# EAGLE design Terrarium (EAGLE 7.5.0)
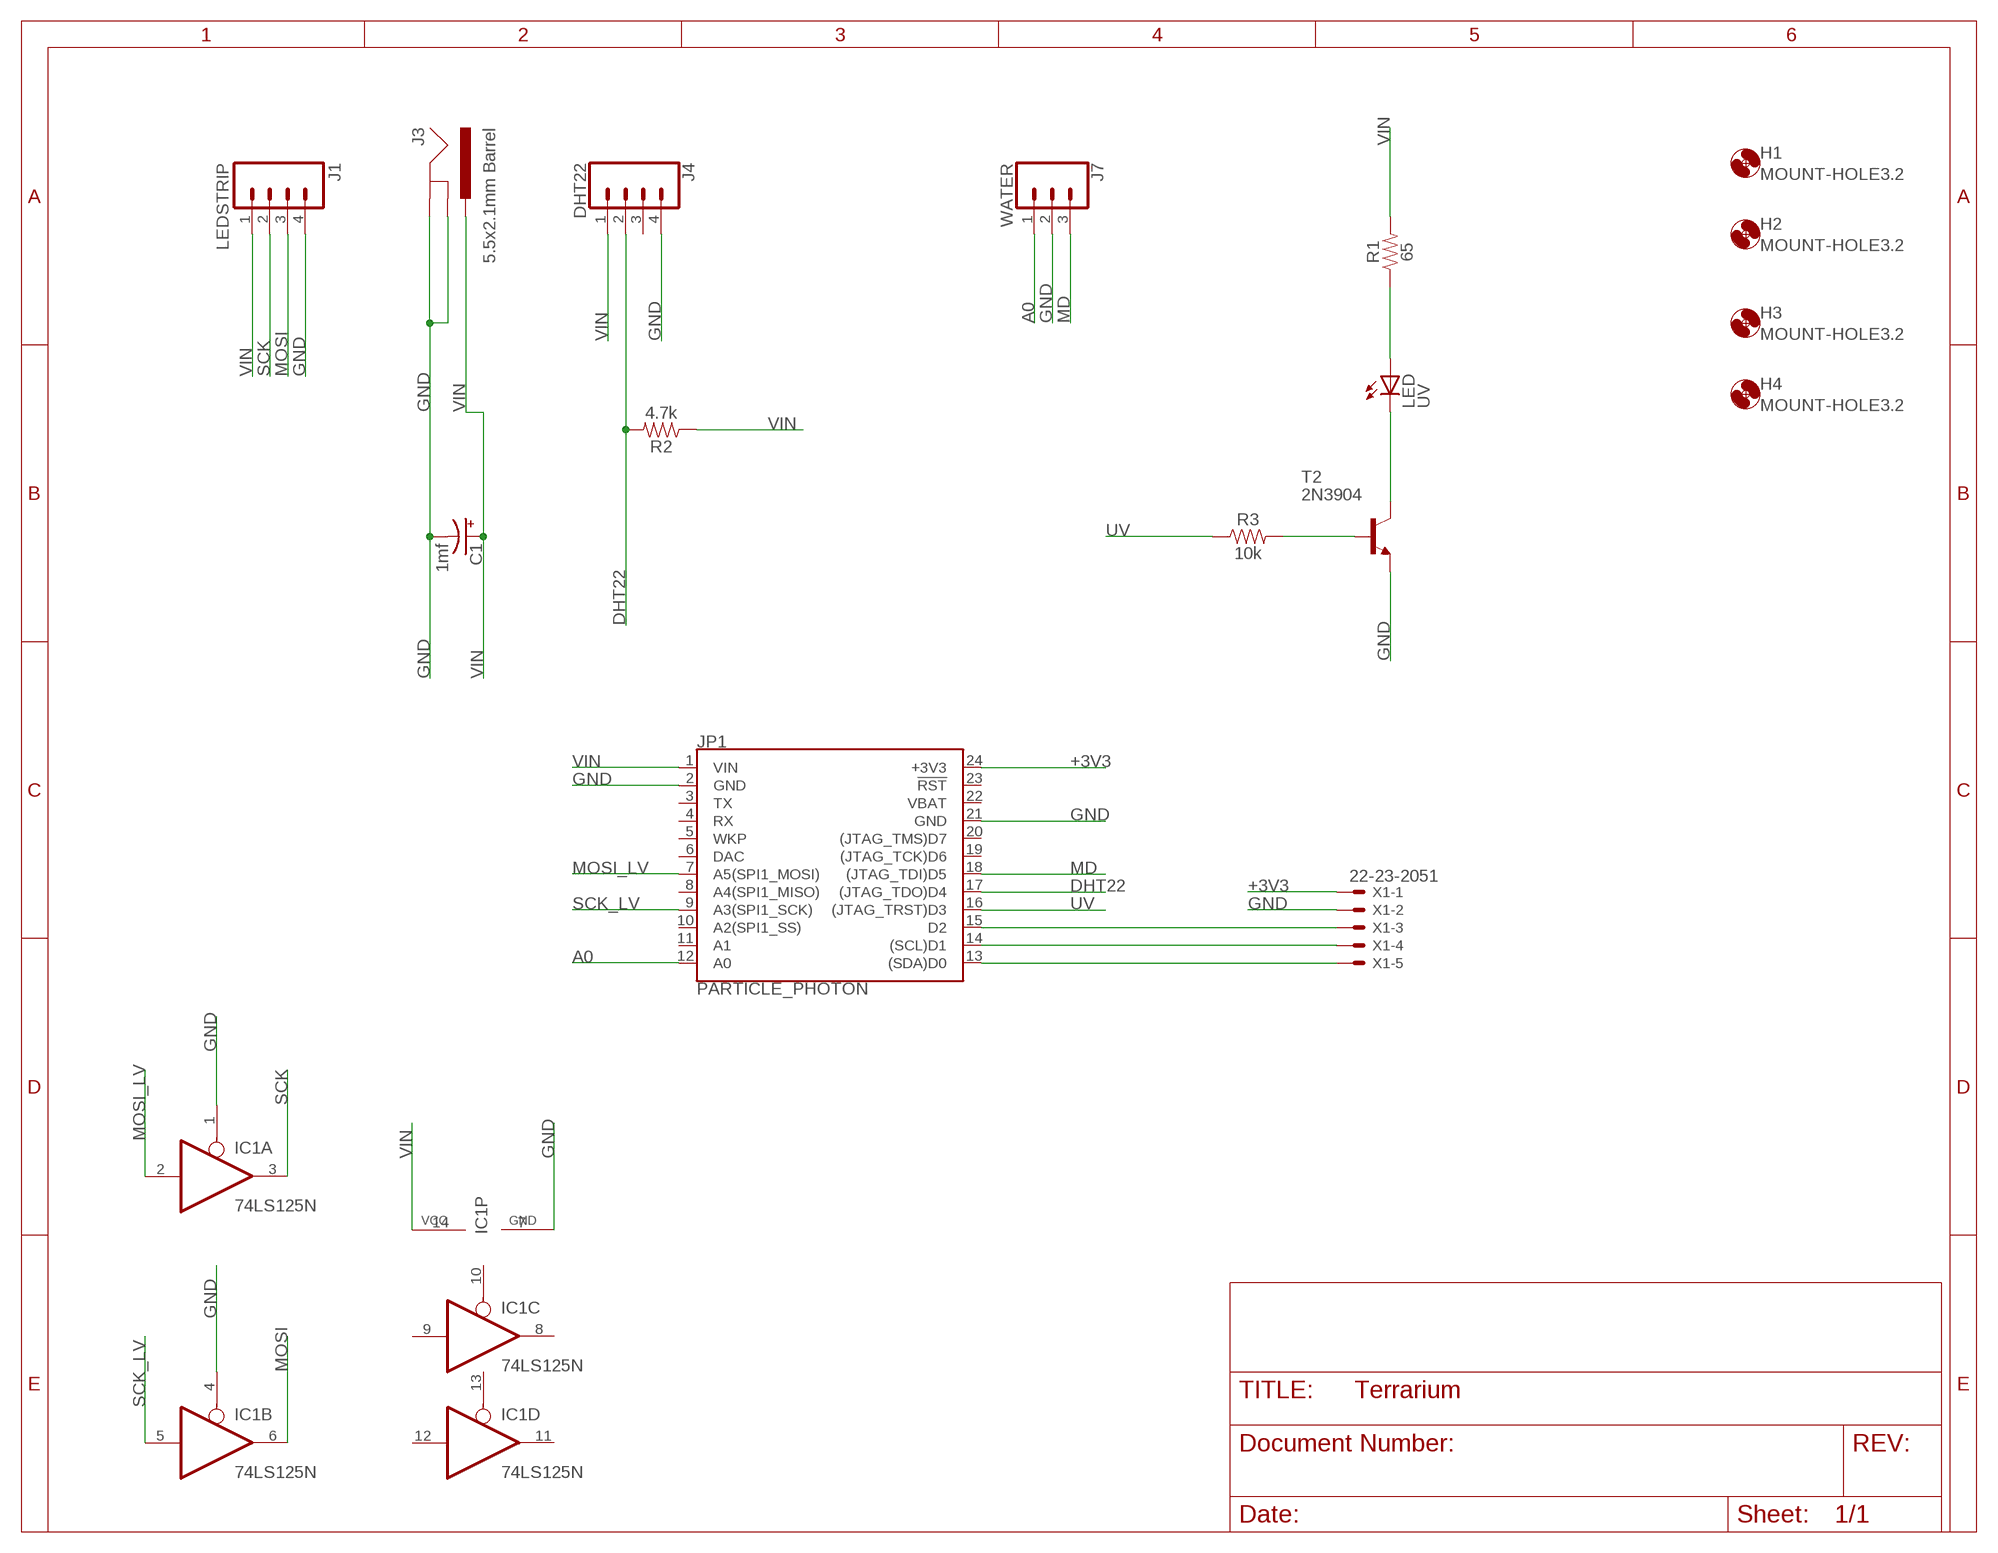
[diagram p0: schematic, sheet 1]

## Parts
C1  1mf  1000UF-RADIAL-5MM-35V-20%-KIT  [CPOL-RADIAL-5MM-10MM-KIT]
H1  MOUNT-HOLE3.2  [3,2]
H2  MOUNT-HOLE3.2  [3,2]
H3  MOUNT-HOLE3.2  [3,2]
H4  MOUNT-HOLE3.2  [3,2]
IC1  74LS125N  [DIL14]
J1  LEDSTRIP  M04PTH  [1X04@1]
J3  5.5x2.1mm Barrel  POWER_JACKSMD  [POWER_JACK_SMD]
J4  DHT22  CONN_04  [1X04]
J7  WATER  CONN_03  [1X03]
JP1  PARTICLE_PHOTON  [PARTICLE_PHOTON]
LED  UV  LED5MM  [LED5MM]
R1  65  100OHM-HORIZ-1/4W-1%  [AXIAL-0.3]
R2  4.7k  10KOHM-HORIZ-1/4W-5%  [AXIAL-0.3]
R3  10k  1KOHM-HORIZ-1/4W-5%  [AXIAL-0.3]
T2  2N3904  [TO92]
X1  22-23-2051  [22-23-2051]

## Nets
+3V3: JP1.24(+3V3) X1.1
A0: J7.1 JP1.12(A0)
DHT22: J4.2 JP1.17((JTAG_TDO)D4) R2.P$2
GND: C1.- IC1.1(A:OE) IC1.4(B:OE) IC1.7(P:GND) J1.4 J3.GND(GNDBREAK) J3.P$4(GND) J4.4 J7.2 JP1.2(GND) JP1.21(GND) T2.3(E) X1.2
MD: J7.3 JP1.18((JTAG_TDI)D5)
MOSI: IC1.6(B:O) J1.3
MOSI_LV: IC1.2(A:I) JP1.7(A5(SPI1_MOSI))
N$2: R3.P$2 T2.2(B)
N$3: JP1.13((SDA)D0) X1.5
N$4: LED.K(C) T2.1(C)
N$5: LED.A R1.P$1
N$6: JP1.14((SCL)D1) X1.4
N$7: JP1.15(D2) X1.3
SCK: IC1.3(A:O) J1.2
SCK_LV: IC1.5(B:I) JP1.9(A3(SPI1_SCK))
UV: JP1.16((JTAG_TRST)D3) R3.P$1
VIN: C1.+ IC1.14(P:VCC) J1.1 J3.VIN0(PWR) J4.1 JP1.1(VIN) R1.P$2 R2.P$1
Unconnected: IC1.8(C:O) IC1.9(C:I) IC1.10(C:OE) IC1.11(D:O) IC1.12(D:I) IC1.13(D:OE) J4.3 JP1.3(TX) JP1.4(RX) JP1.5(WKP) JP1.6(DAC) JP1.8(A4(SPI1_MISO)) JP1.10(A2(SPI1_SS)) JP1.11(A1) JP1.19((JTAG_TCK)D6) JP1.20((JTAG_TMS)D7) JP1.23(!RST!)

## Power pins joined to a net without a drawn wire
VBAT: JP1.22(VBAT)

## Library data of the parts
C1 = SparkFun-Capacitors:1000UF: 1,000µF/1mF ceramic capacitors A capacitor is a passive two-terminal electrical component used to store electrical energy temporarily in an electric field. CAP-08070; PROD_ID: CAP-09538
H1-H4 = holes:MOUNT-HOLE: MOUNTING HOLE with drill center marker
IC1 = adafruit:74*125: Quad bus BUFFER, 3-state
J1 = SparkFun-Connectors:M04: Header 4 Standard 4-pin 0.1" header. Use with straight break away headers (SKU : PRT-00116), right angle break away headers (PRT-00553), swiss pins (PRT-00743), machine pins (PRT-00117), and female headers (PRT-00115). Molex polarized connector foot print use with SKU : PRT-08231 with associated crimp pins and housings. 1MM SMD Version SKU: PRT-10208; PROD_ID: CONN-09696
J3 = SparkFun-Connectors:POWER_JACK: Power Jack Connector This is the standard 5.5mm barrel jack for power. The PTH is the most common, proven, reliable, footprint. The Slot footprint only works if the mill layer is transmitted to the PCB fab house so be warned. Here are the connectors we sell at SparkFun: DC Barrel Power Jack/Connector <https://www.sparkfun.com/products/119> (PRT-00119) DC Barrel Power Jack/Connector (SMD) <https://www.sparkfun.com/products/12748> (PRT-12748) DC Barrel Jack Adapter - Breadboard Compatible <https://www.sparkfun.com/products/10811> (PRT-10811) It is used on this SparkFun product (and many, many others): SparkFun RedBoard - Programmed with Arduino <https://www.sparkfun.com/products/12757> (DEV-12757) Also, if you need a mating power supply or connector, please check these out: Wall Adapter Power Supply - 9VDC 650mA <https://www.sparkfun.com/products/298> (TOL-00298) DC Barrel Jack Adapter - Male <https://www.sparkfun.com/products/10287> (PRT-10287); PROD_ID: CONN-08106; SF_ID: PRT-12748
J4 = SparkFun-Connectors:CONN_04: Multi connection point. Often used as Generic Header-pin footprint for 0.1 inch spaced/style header connections On any of the 0.1 inch spaced packages, you can populate with these: Break Away Headers - Straight <https://www.sparkfun.com/products/116> (PRT-00116) Break Away Male Headers - Right Angle <https://www.sparkfun.com/products/553> (PRT-00553) Female Headers <https://www.sparkfun.com/products/115> (PRT-00115) Break Away Headers - Machine Pin <https://www.sparkfun.com/products/117> (PRT-00117) Break Away Female Headers - Swiss Machine Pin <https://www.sparkfun.com/products/743> (PRT-00743) For SCREWTERMINALS and SPRING TERMINALS visit here: Screw Terimnals on SparkFun.com <https://www.sparkfun.com/search/results?term=Screw+Terminals> (5mm/3.5mm/2.54mm spacing) This device is also useful as a general connection point to wire up your design to another part of your project. Our various solder wires solder well into these plated through hole pads. Hook-Up Wire - Assortment (Stranded, 22 AWG) <https://www.sparkfun.com/products/11375> (PRT-11375) Hook-Up Wire - Assortment (Solid Core, 22 AWG) <https://www.sparkfun.com/products/11367> (PRT-11367) View the entire wire category on our website here <https://www.sparkfun.com/categories/141> Special notes: Molex polarized connector foot print use with SKU : PRT-08231 with associated crimp pins and housings. 1MM SMD Version SKU: PRT-10208; PROD_ID: CONN-09696
J7 = SparkFun-Connectors:CONN_03: Multi connection point. Often used as Generic Header-pin footprint for 0.1 inch spaced/style header connections On any of the 0.1 inch spaced packages, you can populate with these: Break Away Headers - Straight <https://www.sparkfun.com/products/116> (PRT-00116) Break Away Male Headers - Right Angle <https://www.sparkfun.com/products/553> (PRT-00553) Female Headers <https://www.sparkfun.com/products/115> (PRT-00115) Break Away Headers - Machine Pin <https://www.sparkfun.com/products/117> (PRT-00117) Break Away Female Headers - Swiss Machine Pin <https://www.sparkfun.com/products/743> (PRT-00743) Stackable Header - 3 Pin (Female, 0.1") <https://www.sparkfun.com/products/13875> (PRT-13875) For SCREWTERMINALS and SPRING TERMINALS visit here: Screw Terimnals on SparkFun.com <https://www.sparkfun.com/search/results?term=Screw+Terminals> (5mm/3.5mm/2.54mm spacing) This device is also useful as a general connection point to wire up your design to another part of your project. Our various solder wires solder well into these plated through hole pads. Hook-Up Wire - Assortment (Stranded, 22 AWG) <https://www.sparkfun.com/products/11375> (PRT-11375) Hook-Up Wire - Assortment (Solid Core, 22 AWG) <https://www.sparkfun.com/products/11367> (PRT-11367) View the entire wire category on our website here <https://www.sparkfun.com/categories/141> Special notes: Molex polarized connector foot print use with SKU : PRT-08232 with associated crimp pins and housings.
JP1 = SparkFun-Boards:PARTICLE_PHOTON: Particle Photon Footprint of the Particle Photon that is used as a basis for many Photon shields. SparkFun Products: Particle Photon <https://www.sparkfun.com/products/13764> SparkFun Photon ProtoShield <https://www.sparkfun.com/products/13598> SparkFun Photon micro OLED Shield <https://www.sparkfun.com/products/13628> SparkFun Photon IMU Shield <https://www.sparkfun.com/products/13629> SparkFun Photon Battery Shield <https://www.sparkfun.com/products/13626>
LED = adafruit:LED: LED OSRAM: - CHIPLED LG R971, LG N971, LY N971, LG Q971, LY Q971, LO R971, LY R971 LH N974, LH R974 LS Q976, LO Q976, LY Q976 LO Q996 - Hyper CHIPLED LW Q18S LB Q993, LB Q99A, LB R99A - SideLED LS A670, LO A670, LY A670, LG A670, LP A670 LB A673, LV A673, LT A673, LW A673 LH A674 LY A675 LS A676, LA A676, LO A676, LY A676, LW A676 LS A679, LY A679, LG A679 - Hyper Micro SIDELED® LS Y876, LA Y876, LO Y876, LY Y876 LT Y87S - SmartLED LW L88C, LW L88S LB L89C, LB L89S, LG L890 LS L89K, LO L89K, LY L89K LS L896, LA L896, LO L896, LY L896 - TOPLED LS T670, LO T670, LY T670, LG T670, LP T670 LSG T670, LSP T670, LSY T670, LOP T670, LYG T670 LG T671, LOG T671, LSG T671 LB T673, LV T673, LT T673, LW T673 LH T674 LS T676, LA T676, LO T676, LY T676, LB T676, LH T676, LSB T676, LW T676 LB T67C, LV T67C, LT T67C, LS T67K, LO T67K, LY T67K, LW E67C LS E67B, LA E67B, LO E67B, LY E67B, LB E67C, LV E67C, LT E67C LW T67C LS T679, LY T679, LG T679 LS T770, LO T770, LY T770, LG T770, LP T770 LB T773, LV T773, LT T773, LW T773 LH T774 LS E675, LA E675, LY E675, LS T675 LS T776, LA T776, LO T776, LY T776, LB T776 LHGB T686 LT T68C, LB T68C - Hyper Mini TOPLED® LB M676 - Mini TOPLED Santana® LG M470 LS M47K, LO M47K, LY M47K Source: http://www.osram.convergy.de/
R1 = SparkFun-Resistors:100OHM: 100Ω resistor A resistor is a passive two-terminal electrical component that implements electrical resistance as a circuit element. Resistors act to reduce current flow, and, at the same time, act to lower voltage levels within circuits. - Wikipedia; PROD_ID: RES-12181; VALUE: 100
R2 = SparkFun-Resistors:10KOHM: 10kΩ resistor A resistor is a passive two-terminal electrical component that implements electrical resistance as a circuit element. Resistors act to reduce current flow, and, at the same time, act to lower voltage levels within circuits. - Wikipedia; PROD_ID: RES-09435; VALUE: 10k
R3 = SparkFun-Resistors:1KOHM: 1kΩ resistor A resistor is a passive two-terminal electrical component that implements electrical resistance as a circuit element. Resistors act to reduce current flow, and, at the same time, act to lower voltage levels within circuits. - Wikipedia; PROD_ID: RES-08380; VALUE: 1k
T2 = transistor:2N3904: NPN TRANSISTOR
X1 = con-molex:22-23-2051: .100" (2.54mm) Center Header - 5 Pin; MF: MOLEX; MPN: 22-23-2051; OC_FARNELL: 1462952; OC_NEWARK: 38C9178

## Board
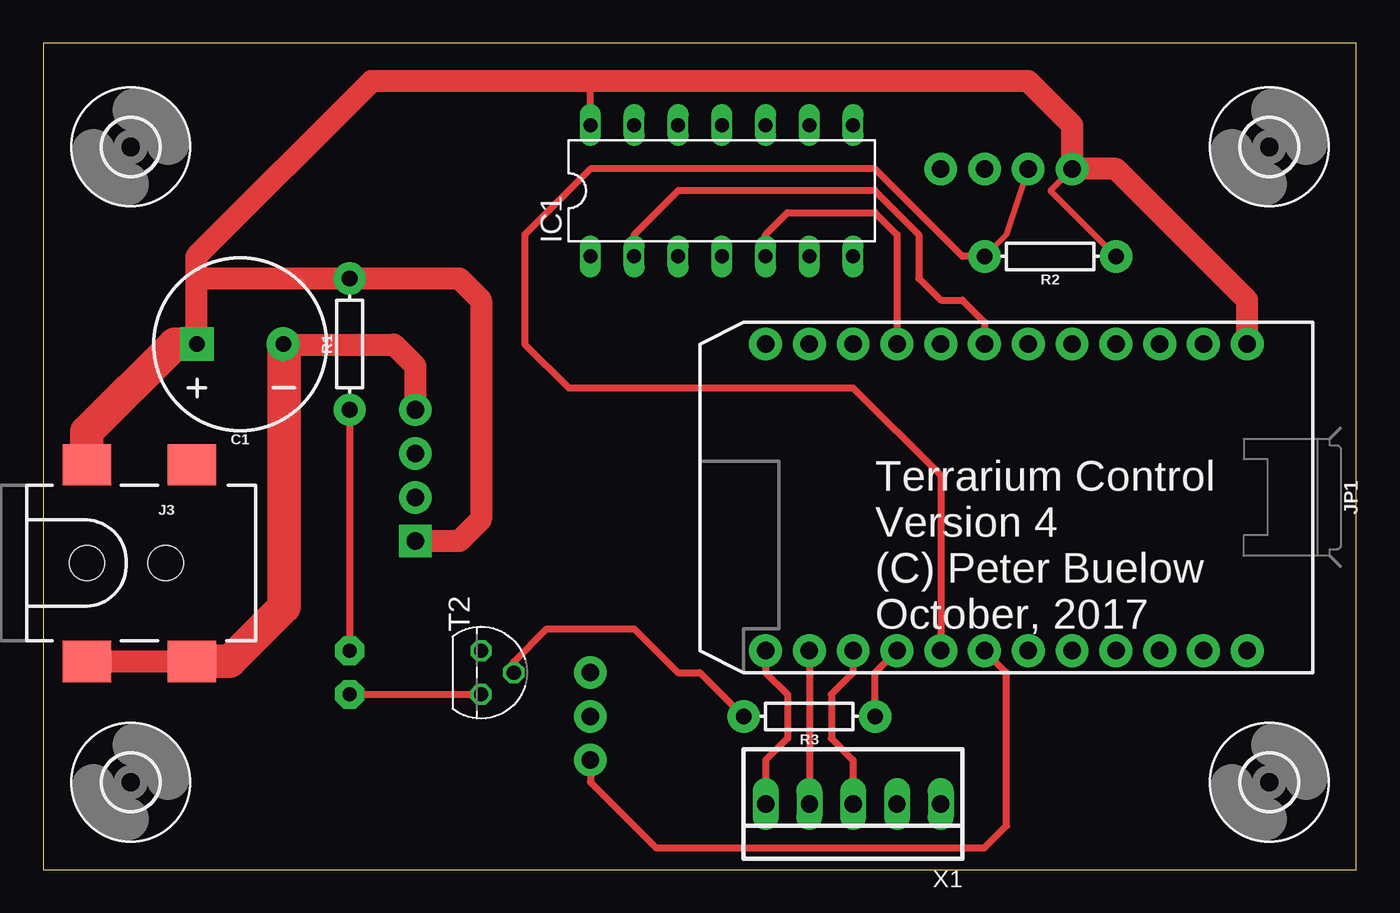
[diagram p1: board, top side]
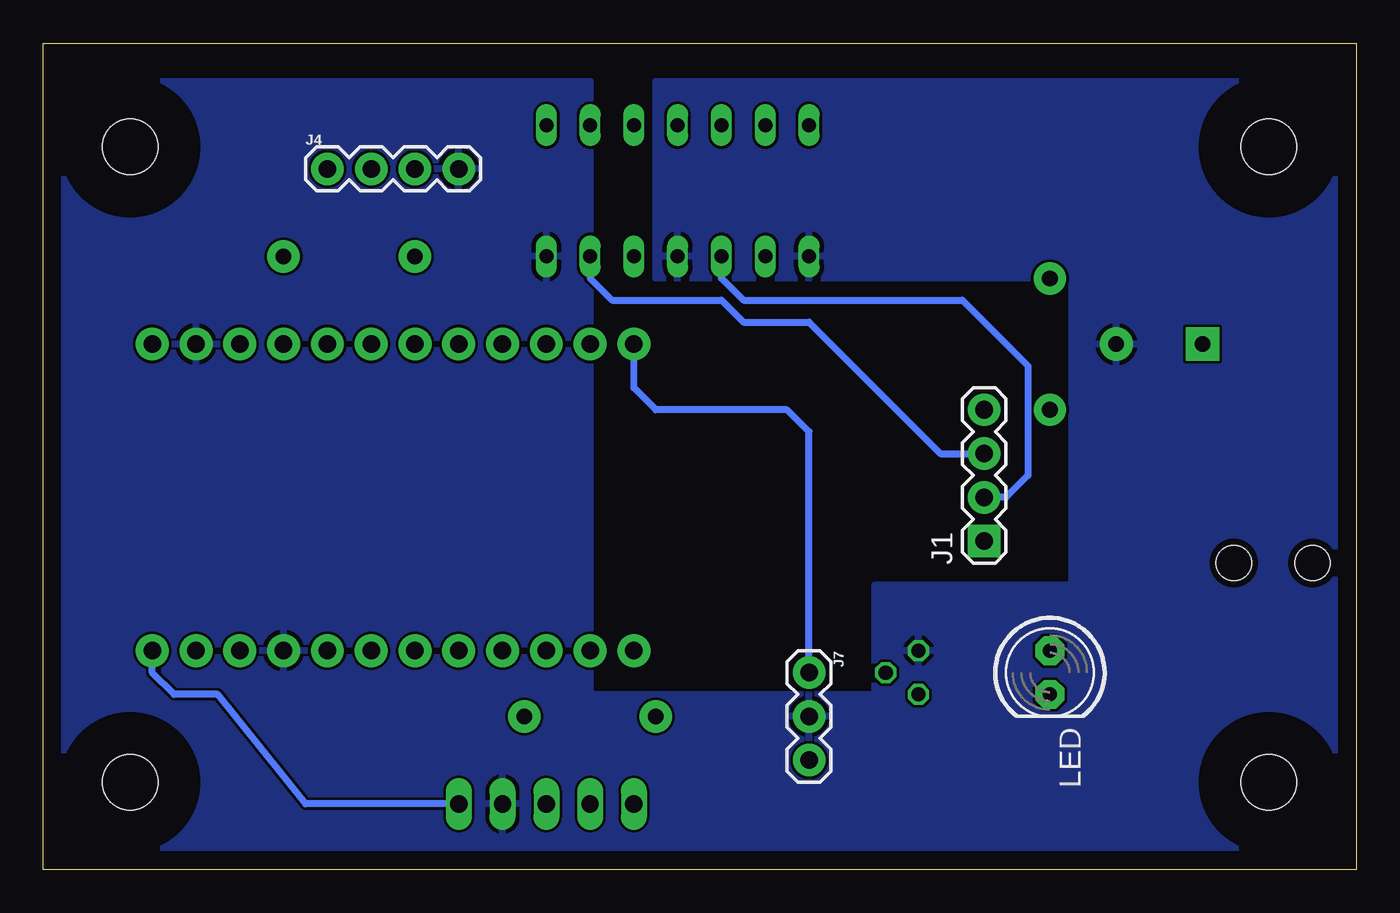
[diagram p2: board, bottom side, seen from below]

Size 76.18 x 47.93 mm. Coordinates in mm from the lower left corner, seen from the top.
Outline: 0,0 76.18,0 76.18,47.93 0,47.93 0,0
Copper layers (1*16): Top 0.0356mm / dielectric 1.5011mm / Bottom 0.0356mm
Design rules "oshpark-2layer": minimum track width 6mil, minimum drill 13mil, track to track 6mil, track to pad 6mil, pad to pad 6mil, via to via 6mil, smd to smd 6mil, copper to edge 15mil, drill to drill 6mil, minimum pad ring 7mil, minimum via ring 7mil, stop-mask expansion 2.5mil, vias tented up to drill 0mil, thermal gap 10mil

### Footprints (pad centres in the part's own frame; a part is rotated, then mirrored left to right if it is on the bottom)
CPOL-RADIAL-5MM-10MM-KIT = drill 0.9 pad 1.93 square: + 2.5,0 | drill 0.9 pad 1.93: - -2.5,0
3,2 = hole 3.2: 0,0
DIL14 = drill 0.813 long: 1 -7.62,-3.81; 2 -5.08,-3.81; 3 -2.54,-3.81; 4 0,-3.81; 5 2.54,-3.81; 6 5.08,-3.81; 7 7.62,-3.81; 8 7.62,3.81; 9 5.08,3.81; 10 2.54,3.81; 11 0,3.81; 12 -2.54,3.81; 13 -5.08,3.81; 14 -7.62,3.81
1X04@1 = drill 1.016 pad 1.88 square: 1 0,0 | drill 1.016 pad 1.88: 2 2.54,0; 3 5.08,0; 4 7.62,0
POWER_JACK_SMD = smd 2.8 x 2.4: GND 0,-5.7; P$4 6.1,-5.7; VIN0 0,5.7; VIN1 6.1,5.7 | hole 2.032: 0,0; 4.572,0
1X04 = drill 1.016 pad 1.88: 1 0,0; 2 2.54,0; 3 5.08,0; 4 7.62,0
1X03 = drill 1.016 pad 1.88: 1 0,0; 2 2.54,0; 3 5.08,0
PARTICLE_PHOTON = drill 1.016 pad 1.905: 1 -8.89,13.97; 2 -8.89,11.43; 3 -8.89,8.89; 4 -8.89,6.35; 5 -8.89,3.81; 6 -8.89,1.27; 7 -8.89,-1.27; 8 -8.89,-3.81; 9 -8.89,-6.35; 10 -8.89,-8.89; 11 -8.89,-11.43; 12 -8.89,-13.97; 13 8.89,-13.97; 14 8.89,-11.43; 15 8.89,-8.89; 16 8.89,-6.35; 17 8.89,-3.81; 18 8.89,-1.27; 19 8.89,1.27; 20 8.89,3.81; 21 8.89,6.35; 22 8.89,8.89; 23 8.89,11.43; 24 8.89,13.97
LED5MM = drill 0.813 pad 1.676 octagon: A -1.27,0; K 1.27,0
AXIAL-0.3 = drill 0.9 pad 1.88: P$1 -3.81,0; P$2 3.81,0
TO92 = drill 0.813 octagon: 1 1.27,0; 2 0,1.905; 3 -1.27,0
22-23-2051 = drill 1 long: 1 -5.08,0; 2 -2.54,0; 3 0,0; 4 2.54,0; 5 5.08,0

### Placement (x,y rotation side)
C1  11.43,30.48 180 top
H1  5.08,41.91 0 top
H2  5.08,5.08 0 top
H3  71.12,5.08 0 top
H4  71.12,41.91 0 top
IC1  39.37,39.37 0 top
J1  21.59,19.05 90 bottom
J3  2.54,17.78 0 top
J4  59.69,40.64 0 bottom
J7  31.75,11.43 270 bottom
JP1  55.88,21.59 270 top
LED  17.78,11.43 270 bottom
R1  17.78,30.48 90 top
R2  58.42,35.56 180 top
R3  44.45,8.89 180 top
T2  25.4,11.43 270 top
X1  46.99,3.81 180 top

### Tracks (layer width: path | path; a pad name or v marks a point on that pad's centre or on a via)
+3V3
  Bottom 0.406: X1.1 60.96,3.81 66.04,10.16 68.58,10.16 69.85,11.43 JP1.24
A0
  Bottom 0.406: J7.1 31.75,25.4 33.02,26.67 40.64,26.67 41.91,27.94 JP1.12
DHT22
  Top 0.305: J4.2 55.88,36.83 R2.P$2
  Top 0.406: R2.P$2 53.34,35.56 48.26,40.64 31.75,40.64 27.94,36.83 27.94,30.48 30.48,27.94 46.99,27.94 52.07,22.86 JP1.17
GND
  Top 1.27: J3.GND J3.P$4 | 13.97,30.44 20.36,30.44 21.59,29.21 J1.4
  Top 1.93: J3.P$4 10.81,12.08 13.97,15.24 13.97,30.44 C1.-
  pour Bottom: 1.27,45.72 1.27,1.27 74.93,1.27 74.93,45.72 44.45,45.72 44.45,10.16 27.94,10.16 27.94,16.51 16.51,16.51 16.51,34.29 40.64,34.29 40.64,45.72
MD
  Top 0.406: J7.3 31.75,5.08 35.56,1.27 54.61,1.27 55.88,2.54 55.88,11.43 JP1.18
MOSI
  Bottom 0.406: IC1.6 44.45,34.29 43.18,33.02 36.83,33.02 35.56,31.75 31.75,31.75 24.13,24.13 J1.3
MOSI_LV
  Top 0.406: JP1.7 54.61,31.75 53.34,33.02 52.07,33.02 50.8,34.29 50.8,36.83 48.26,39.37 36.83,39.37 34.29,36.83 IC1.2
N$2
  Top 0.406: T2.2 27.3,12.06 29.21,13.97 34.29,13.97 36.83,11.43 38.1,11.43 R3.P$2
N$3
  Top 0.406: JP1.13 41.91,11.43 43.18,10.16 43.18,7.62 41.91,6.35 X1.5
N$4
  Top 0.406: LED.K T2.1
N$5
  Top 0.406: R1.P$1 LED.A
N$6
  Top 0.406: JP1.14 X1.4
N$7
  Top 0.406: JP1.15 46.99,11.43 45.72,10.16 45.72,7.62 46.99,6.35 X1.3
SCK
  Bottom 0.406: IC1.3 36.83,34.29 35.56,33.02 22.86,33.02 19.05,29.21 19.05,22.86 20.32,21.59 J1.2
SCK_LV
  Top 0.406: IC1.5 41.91,36.83 43.18,38.1 48.26,38.1 49.53,36.83 JP1.9
UV
  Top 0.406: R3.P$1 48.26,11.43 JP1.16
VIN
  Top 0.305: J4.1 58.42,39.37 R2.P$1
  Top 0.406: IC1.14 31.75,45.72
  Top 1.27: 8.89,34.29 8.89,35.56 19.05,45.72 31.75,45.72 57.15,45.72 59.69,43.18 J4.1 62.23,40.64 69.85,33.02 JP1.1 | 8.89,34.29 8.89,30.52 C1.+ | 8.89,34.29 R1.P$2 24.13,34.29 25.4,33.02 25.4,20.32 24.13,19.05 J1.1
  Top 1.93: J3.VIN0 2.54,25.4 7.62,30.48 C1.+

### Text on the board
_tsilk: Terrarium Control / Version 4 / (C) Peter Buelow / October, 2017